# EAGLE design 4bit_ram (EAGLE 6.5.0)
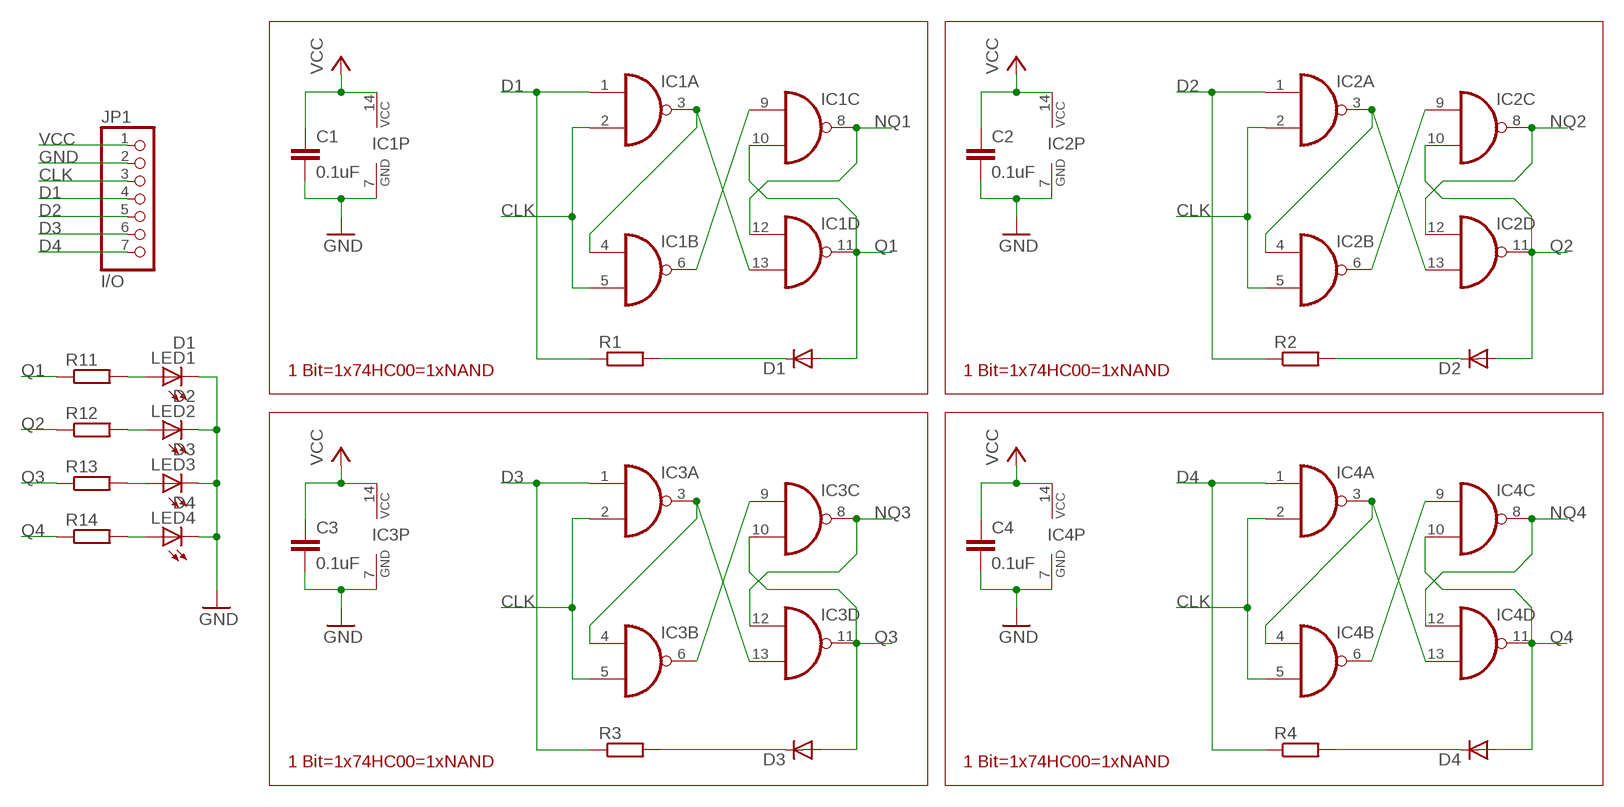
[diagram p0: schematic, sheet 1]

## Parts
C1  0.1uF  C-EU025-025X050  [C025-025X050]
C2  0.1uF  C-EU025-025X050  [C025-025X050]
C3  0.1uF  C-EU025-025X050  [C025-025X050]
C4  0.1uF  C-EU025-025X050  [C025-025X050]
D1  1N4148DO35-7  [DO35-7]
D2  1N4148DO35-7  [DO35-7]
D3  1N4148DO35-7  [DO35-7]
D4  1N4148DO35-7  [DO35-7]
IC1  74HC00N  [DIL14]
IC2  74HC00N  [DIL14]
IC3  74HC00N  [DIL14]
IC4  74HC00N  [DIL14]
JP1  I/O  PINHD-1X7  [1X07]
LED1  D1  LED3MM  [LED3MM]
LED2  D2  LED3MM  [LED3MM]
LED3  D3  LED3MM  [LED3MM]
LED4  D4  LED3MM  [LED3MM]
R1  10K  R-EU_0204/7  [0204/7]
R2  10K  R-EU_0204/7  [0204/7]
R3  10K  R-EU_0204/7  [0204/7]
R4  10K  R-EU_0204/7  [0204/7]
R11  470  R-EU_0204/7  [0204/7]
R12  470  R-EU_0204/7  [0204/7]
R13  470  R-EU_0204/7  [0204/7]
R14  470  R-EU_0204/7  [0204/7]

## Nets
CLK: IC1.2(A:I1) IC1.5(B:I1) IC2.2(A:I1) IC2.5(B:I1) IC3.2(A:I1) IC3.5(B:I1) IC4.2(A:I1) IC4.5(B:I1) JP1.3
D1: IC1.1(A:I0) JP1.4 R1.1
D2: IC2.1(A:I0) JP1.5 R2.1
D3: IC3.1(A:I0) JP1.6 R3.1
D4: IC4.1(A:I0) JP1.7 R4.1
GND: C1.2 C2.2 C3.2 C4.2 IC1.7(P:GND) IC2.7(P:GND) IC3.7(P:GND) IC4.7(P:GND) JP1.2 LED1.K(C) LED2.K(C) LED3.K(C) LED4.K(C)
N$1: D1.C R1.2
N$2: IC3.6(B:O) IC3.9(C:I0)
N$3: IC1.3(A:O) IC1.4(B:I0) IC1.13(D:I1)
N$4: IC1.6(B:O) IC1.9(C:I0)
N$5: IC2.3(A:O) IC2.4(B:I0) IC2.13(D:I1)
N$6: D2.C R2.2
N$7: IC2.6(B:O) IC2.9(C:I0)
N$8: IC4.6(B:O) IC4.9(C:I0)
N$9: LED1.A R11.2
N$11: IC3.3(A:O) IC3.4(B:I0) IC3.13(D:I1)
N$12: D3.C R3.2
N$14: IC4.3(A:O) IC4.4(B:I0) IC4.13(D:I1)
N$15: D4.C R4.2
N$16: LED2.A R12.2
N$18: LED3.A R13.2
N$20: LED4.A R14.2
NQ1: IC1.8(C:O) IC1.12(D:I0)
NQ2: IC2.8(C:O) IC2.12(D:I0)
NQ3: IC3.8(C:O) IC3.12(D:I0)
NQ4: IC4.8(C:O) IC4.12(D:I0)
Q1: D1.A IC1.10(C:I1) IC1.11(D:O) R11.1
Q2: D2.A IC2.10(C:I1) IC2.11(D:O) R12.1
Q3: D3.A IC3.10(C:I1) IC3.11(D:O) R13.1
Q4: D4.A IC4.10(C:I1) IC4.11(D:O) R14.1
VCC: C1.1 C2.1 C3.1 C4.1 IC1.14(P:VCC) IC2.14(P:VCC) IC3.14(P:VCC) IC4.14(P:VCC) JP1.1

## Notes on the sheet
- 1 Bit=1x74HC00=1xNAND | 1 Bit=1x74HC00=1xNAND
- 1 Bit=1x74HC00=1xNAND | 1 Bit=1x74HC00=1xNAND

## Library data of the parts
C1-C4 = rcl:C-EU: CAPACITOR, European symbol
D1-D4 = diode:1N4148: DIODE high speed (Philips)
IC1-IC4 = 74xx-eu:74*00: Quad 2-input NAND gate
JP1 = pinhead:PINHD-1X7: PIN HEADER
LED1-LED4 = led:LED: LED OSRAM: - CHIPLED LG R971, LG N971, LY N971, LG Q971, LY Q971, LO R971, LY R971 LH N974, LH R974 LS Q976, LO Q976, LY Q976 LO Q996 - Hyper CHIPLED LW Q18S LB Q993, LB Q99A, LB R99A - SideLED LS A670, LO A670, LY A670, LG A670, LP A670 LB A673, LV A673, LT A673, LW A673 LH A674 LY A675 LS A676, LA A676, LO A676, LY A676, LW A676 LS A679, LY A679, LG A679 - Hyper Micro SIDELED® LS Y876, LA Y876, LO Y876, LY Y876 LT Y87S - SmartLED LW L88C, LW L88S LB L89C, LB L89S, LG L890 LS L89K, LO L89K, LY L89K LS L896, LA L896, LO L896, LY L896 - TOPLED LS T670, LO T670, LY T670, LG T670, LP T670 LSG T670, LSP T670, LSY T670, LOP T670, LYG T670 LG T671, LOG T671, LSG T671 LB T673, LV T673, LT T673, LW T673 LH T674 LS T676, LA T676, LO T676, LY T676, LB T676, LH T676, LSB T676, LW T676 LB T67C, LV T67C, LT T67C, LS T67K, LO T67K, LY T67K, LW E67C LS E67B, LA E67B, LO E67B, LY E67B, LB E67C, LV E67C, LT E67C LW T67C LS T679, LY T679, LG T679 LS T770, LO T770, LY T770, LG T770, LP T770 LB T773, LV T773, LT T773, LW T773 LH T774 LS E675, LA E675, LY E675, LS T675 LS T776, LA T776, LO T776, LY T776, LB T776 LHGB T686 LT T68C, LB T68C - Hyper Mini TOPLED® LB M676 - Mini TOPLED Santana® LG M470 LS M47K, LO M47K, LY M47K Source: http://www.osram.convergy.de LUXEON: - LUMILED® LXK2-PW12-R00, LXK2-PW12-S00, LXK2-PW14-U00, LXK2-PW14-V00 LXK2-PM12-R00, LXK2-PM12-S00, LXK2-PM14-U00 LXK2-PE12-Q00, LXK2-PE12-R00, LXK2-PE12-S00, LXK2-PE14-T00, LXK2-PE14-U00 LXK2-PB12-K00, LXK2-PB12-L00, LXK2-PB12-M00, LXK2-PB14-N00, LXK2-PB14-P00, LXK2-PB14-Q00 LXK2-PR12-L00, LXK2-PR12-M00, LXK2-PR14-Q00, LXK2-PR14-R00 LXK2-PD12-Q00, LXK2-PD12-R00, LXK2-PD12-S00 LXK2-PH12-R00, LXK2-PH12-S00 LXK2-PL12-P00, LXK2-PL12-Q00, LXK2-PL12-R00 Source: www.luxeon.com KINGBRIGHT: KA-3528ASYC Source: www.kingbright.com
R1-R4 R11-R14 = rcl:R-EU_: RESISTOR, European symbol

## Net classes
0 default: width 0.406 mm, drill 0.508 mm

## Board
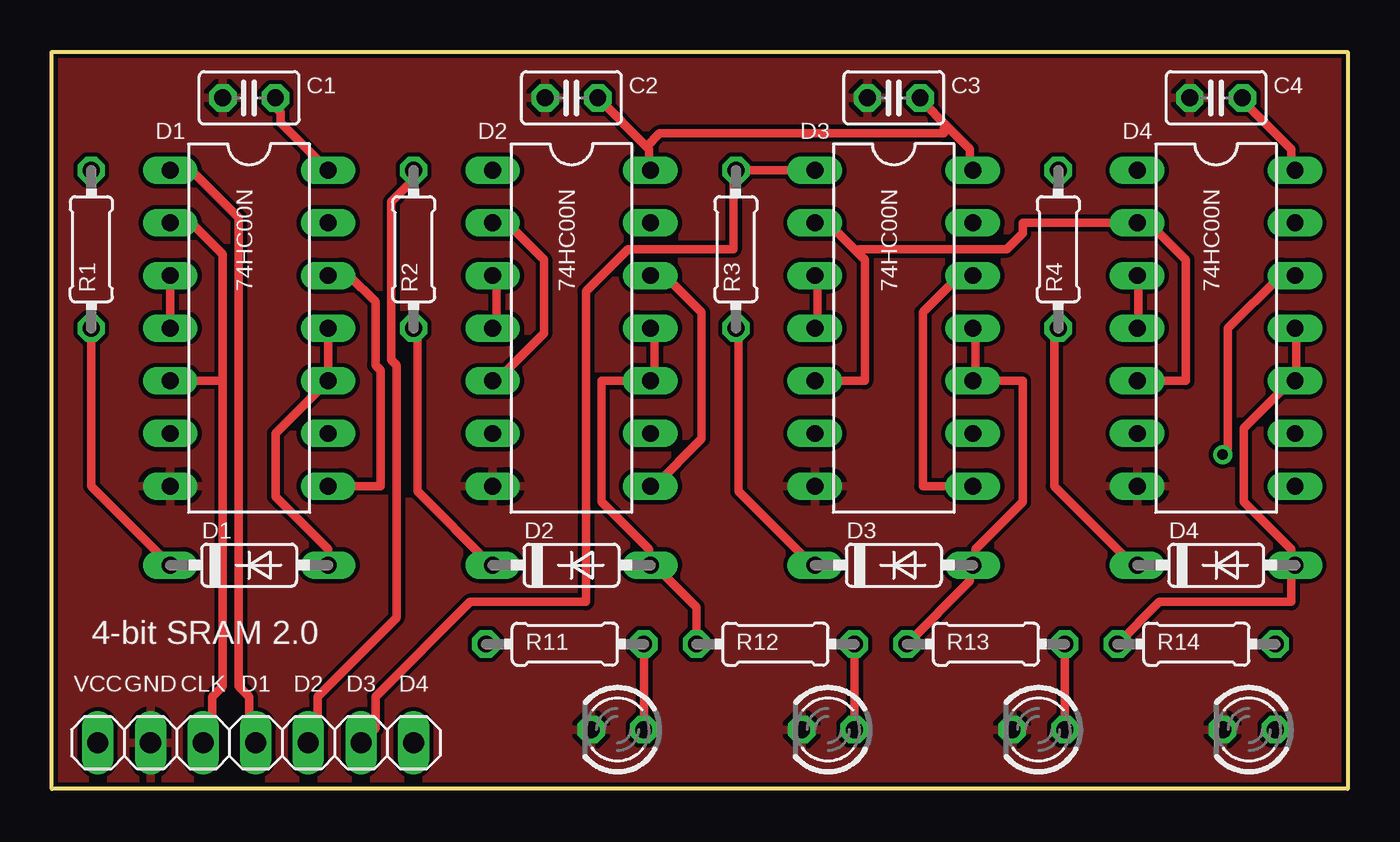
[diagram p1: board, top side]
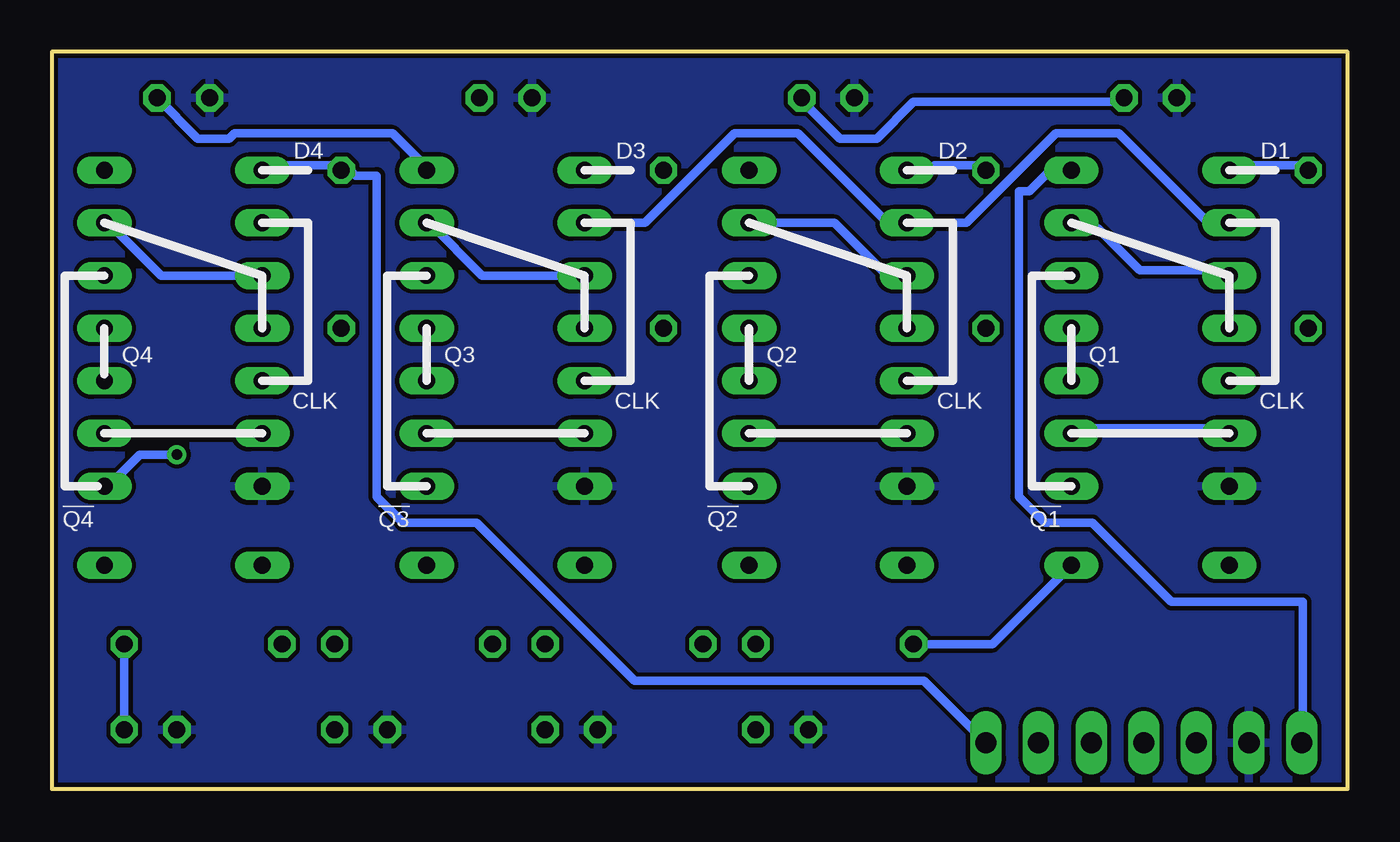
[diagram p2: board, bottom side, seen from below]

Size 62.55 x 35.56 mm. Coordinates in mm from the lower left corner, seen from the top.
Outline: 0,0 0,35.56 62.55,35.56 62.55,0 0,0
Copper layers (1*16): Top 0.035mm / dielectric 1.5mm / Bottom 0.035mm
Design rules "default *": minimum track width 10mil, minimum drill 20mil, track to track 8mil, track to pad 8mil, pad to pad 8mil, via to via 8mil, smd to smd 8mil, copper to edge 8mil, drill to drill 8mil, minimum pad ring 10mil, minimum via ring 8mil, stop-mask expansion 4mil, vias tented up to drill 0mil, thermal gap 10mil

### Footprints (pad centres in the part's own frame; a part is rotated, then mirrored left to right if it is on the bottom)
C025-025X050 = drill 0.813 octagon: 1 -1.27,0; 2 1.27,0
DO35-7 = drill 0.813 long: A 3.81,0; C -3.81,0
DIL14 = drill 0.813 long: 1 -7.62,-3.81; 2 -5.08,-3.81; 3 -2.54,-3.81; 4 0,-3.81; 5 2.54,-3.81; 6 5.08,-3.81; 7 7.62,-3.81; 8 7.62,3.81; 9 5.08,3.81; 10 2.54,3.81; 11 0,3.81; 12 -2.54,3.81; 13 -5.08,3.81; 14 -7.62,3.81
1X07 = drill 1.016 long: 1 -7.62,0; 2 -5.08,0; 3 -2.54,0; 4 0,0; 5 2.54,0; 6 5.08,0; 7 7.62,0
LED3MM = drill 0.813 octagon: A -1.27,0; K 1.27,0
0204/7 = drill 0.813 octagon: 1 -3.81,0; 2 3.81,0

### Placement (x,y rotation side)
C1  9.52,33.34 180 top
C2  25.08,33.34 180 top
C3  40.64,33.34 180 top
C4  56.2,33.34 180 top
D1  9.52,10.8 0 top
D2  25.08,10.8 0 top
D3  40.64,10.8 0 top
D4  56.2,10.8 0 top
IC1  9.52,22.23 270 top
IC2  25.08,22.23 270 top
IC3  40.64,22.23 270 top
IC4  56.2,22.23 270 top
JP1  9.84,2.22 0 top
LED1  27.3,2.86 180 top
LED2  37.46,2.86 180 top
LED3  47.62,2.86 180 top
LED4  57.79,2.86 180 top
R1  1.9,26.04 270 top
R2  17.46,26.04 270 top
R3  33.02,26.04 270 top
R4  48.58,26.04 270 top
R11  24.77,6.99 0 top
R12  34.92,6.99 0 top
R13  45.09,6.99 0 top
R14  55.24,6.99 0 top

### Tracks (layer width: path | path; a pad name or v marks a point on that pad's centre or on a via)
CLK
  Top 0.406: IC4.5 54.74,19.69 54.74,25.53 52.96,27.3 IC4.2 46.86,27.3 46.86,26.8 46.1,26.04 38.99,26.04 38.86,25.91 | IC3.5 39.24,19.69 39.24,25.53 38.86,25.91 | 38.86,25.91 37.46,27.3 IC3.2 | IC2.2 21.97,27.3 23.75,25.53 23.75,21.97 21.46,19.69 IC2.5 | 8.25,19.69 IC1.5 | 8.25,19.69 8.25,25.78 6.73,27.3 IC1.2 | JP1.3 7.75,2.67 7.75,4.45 8.25,4.95 8.25,19.69
  Bottom 0.406: IC1.2 6.73,27.3 11.05,31.62 14.1,31.62 18.41,27.3 IC2.2 22.23,27.3 26.54,31.62 29.59,31.62 33.91,27.3 IC3.2
D1
  Top 0.406: IC1.1 6.73,29.84 9.02,27.56 9.02,4.95 9.52,4.45 9.52,2.67 9.78,2.41 JP1.4
  Bottom 0.406: R1.1 2.16,30.1 5.46,30.1 IC1.1
D2
  Top 0.406: JP1.5 12.83,2.67 12.83,4.45 16.64,8.26 16.64,20.45 16.38,20.7 16.38,28.32 17.4,29.34 17.4,29.84 R2.1
  Bottom 0.406: IC2.1 20.19,29.84 19.94,30.1 17.91,30.1 17.65,29.84 R2.1
D3
  Top 0.406: IC3.1 R3.1 32.89,29.84 32.89,26.04 27.81,26.04 25.78,24 25.78,9.02 20.19,9.02 15.62,4.45 15.62,2.92 JP1.6
D4
  Bottom 0.406: IC4.1 52.2,29.84 51.94,30.1 48.89,30.1 48.64,29.84 R4.1 48.13,29.84 47.88,29.59 46.86,29.59 46.86,14.1 45.59,12.83 42.04,12.83 34.42,5.21 20.45,5.21 JP1.7
GND
  pour Top: -0.64,-0.32 -0.64,35.88 63.5,36.2 63.5,-0.32
  pour Bottom: -0.64,-0.32 -0.64,35.88 63.5,35.88 63.5,-0.32
N$1
  Top 0.406: D1.C 1.9,14.61 R1.2
N$2
  Bottom 0.406: IC3.9 IC3.6
N$3
  Top 0.406: IC1.3 IC1.4
  Bottom 0.406: IC1.13 13.08,27.05 12.06,27.05 10.03,25.02 5.97,25.02 IC1.3
N$4
  Bottom 0.406: IC1.6 5.97,17.4 13.08,17.4 IC1.9
N$5
  Top 0.406: IC2.4 21.46,22.23 21.46,24.77 IC2.3
  Bottom 0.406: IC2.13 24.77,27.3 22.23,24.77 IC2.3
N$6
  Top 0.406: D2.C 21.21,10.8 17.65,14.35 17.65,22.23 R2.2
N$7
  Bottom 0.406: IC2.9 IC2.6
N$8
  Bottom 0.406: IC4.9 IC4.6
N$9
  Top 0.406: R11.2 LED1.A
N$11
  Top 0.406: IC3.4 36.96,22.23 36.96,24.77 IC3.3
  Bottom 0.406: IC3.3 41.78,24.77 44.32,27.3 IC3.13
N$12
  Top 0.406: D3.C 36.7,10.8 33.15,14.35 33.15,22.23 R3.2
N$14
  Top 0.406: IC4.4 52.45,22.23 52.45,24.77 IC4.3
  Bottom 0.406: IC4.3 57.28,24.77 59.82,27.3 IC4.13
N$15
  Top 0.406: D4.C 52.2,10.8 48.39,14.61 48.39,22.23 R4.2
N$16
  Top 0.406: R12.2 LED2.A
N$18
  Top 0.406: R13.2 LED3.A
N$20
  Bottom 0.406: R14.2 LED4.A
NQ1
  Top 0.406: IC1.8 15.88,14.61 15.88,20.19 15.62,20.45 15.62,23.5 14.35,24.77 IC1.12
NQ2
  Top 0.406: IC2.12 29.59,24.77 31.37,22.99 31.37,16.89 29.08,14.61 IC2.8
NQ3
  Top 0.406: IC3.8 42.04,14.61 42.04,22.99 43.81,24.77 IC3.12
NQ4  (via drill 0.51)
  Top 0.406: v56.51,16.13 56.77,16.38 56.77,22.23 59.31,24.77 IC4.12
  Bottom 0.406: v56.51,16.13 58.29,16.13 59.82,14.61 IC4.8
Q1
  Top 0.406: IC1.11 IC1.10 10.79,17.15 10.79,14.1 13.34,11.56 D1.A
  Bottom 0.406: D1.A 17.14,6.99 R11.1
Q2
  Top 0.406: IC2.11 29.08,22.23 29.08,19.69 IC2.10 26.54,19.69 26.54,13.84 28.83,11.56 28.83,10.8 D2.A 29.08,10.8 31.12,8.76 R12.1
Q3
  Top 0.406: 44.58,19.69 44.58,22.23 IC3.11 | R13.1 44.32,10.03 44.32,10.8 D3.A 44.58,10.8 44.58,11.56 46.86,13.84 46.86,19.69 44.58,19.69 | 44.58,19.69 IC3.10
Q4
  Top 0.406: IC4.11 60.07,22.23 60.07,19.69 IC4.10 59.82,19.69 57.53,17.4 57.53,13.84 59.82,11.56 59.82,10.8 | R14.1 53.47,9.02 59.82,9.02 59.82,10.8 | 59.82,10.8 D4.A
VCC
  Top 0.406: C4.1 57.53,33.15 59.82,30.86 59.82,29.84 IC4.14 60.07,29.84 | 28.7,30.99 28.83,30.86 28.83,29.84 IC2.14 29.08,29.84 | 28.7,30.99 C2.1 | 44.58,29.84 IC3.14 44.32,29.84 44.32,30.86 43.18,32 | 43.18,32 42.04,33.15 C3.1 | 28.7,30.99 29.34,31.62 43.05,31.62 43.05,31.88 43.18,32 | IC1.14 11.05,32.13 11.05,32.64 10.79,32.89 C1.1
  Bottom 0.406: C4.1 55.5,31.37 53.98,31.37 53.72,31.62 46.1,31.62 44.32,29.84 IC3.14 | IC1.14 14.35,29.84 15.37,28.83 15.88,28.83 15.88,14.1 14.61,12.83 12.32,12.83 8.51,9.02 2.16,9.02 2.16,2.41 JP1.1 | C2.1 26.29,33.15 24.51,31.37 22.73,31.37 20.95,33.15 10.79,33.15 C1.1

### Text on the board
tNames: D1 | D2 | D3 | D4 | 4-bit SRAM 2.0 | VCC | GND | CLK | D1 | D2 | D3 | D4
bNames: D1 | D2 | D3 | D4 | Q1 | Q2 | Q3 | Q4 | CLK | CLK | CLK | CLK | !Q1 | !Q2 | !Q3 | !Q4